# Altium schematic sheet Leaf.SchDoc
size A
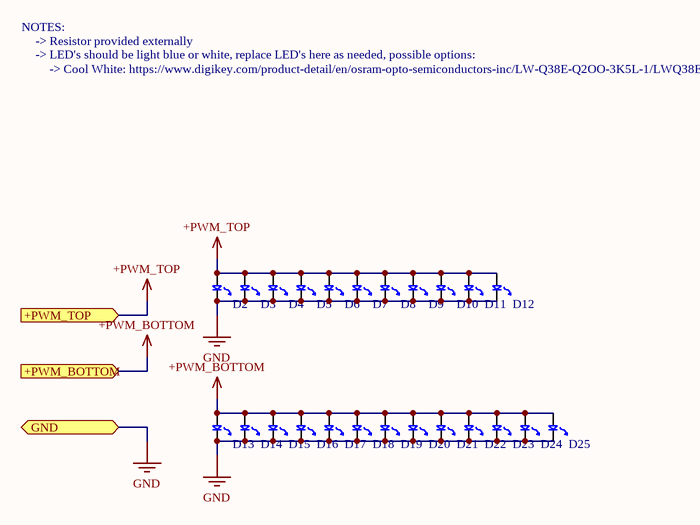
[diagram p0: Leaf.SchDoc]

## Parts
D2  LED_LBQ39G_BLUE  [LED_0603P_BLUE]  (value not drawn)
D3  LED_LBQ39G_BLUE  [LED_0603P_BLUE]  (value not drawn)
D4  LED_LBQ39G_BLUE  [LED_0603P_BLUE]  (value not drawn)
D5  LED_LBQ39G_BLUE  [LED_0603P_BLUE]  (value not drawn)
D6  LED_LBQ39G_BLUE  [LED_0603P_BLUE]  (value not drawn)
D7  LED_LBQ39G_BLUE  [LED_0603P_BLUE]  (value not drawn)
D8  LED_LBQ39G_BLUE  [LED_0603P_BLUE]  (value not drawn)
D9  LED_LBQ39G_BLUE  [LED_0603P_BLUE]  (value not drawn)
D10  LED_LBQ39G_BLUE  [LED_0603P_BLUE]  (value not drawn)
D11  LED_LBQ39G_BLUE  [LED_0603P_BLUE]  (value not drawn)
D12  LED_LBQ39G_BLUE  [LED_0603P_BLUE]  (value not drawn)
D13  LED_LBQ39G_BLUE  [LED_0603P_BLUE]  (value not drawn)
D14  LED_LBQ39G_BLUE  [LED_0603P_BLUE]  (value not drawn)
D15  LED_LBQ39G_BLUE  [LED_0603P_BLUE]  (value not drawn)
D16  LED_LBQ39G_BLUE  [LED_0603P_BLUE]  (value not drawn)
D17  LED_LBQ39G_BLUE  [LED_0603P_BLUE]  (value not drawn)
D18  LED_LBQ39G_BLUE  [LED_0603P_BLUE]  (value not drawn)
D19  LED_LBQ39G_BLUE  [LED_0603P_BLUE]  (value not drawn)
D20  LED_LBQ39G_BLUE  [LED_0603P_BLUE]  (value not drawn)
D21  LED_LBQ39G_BLUE  [LED_0603P_BLUE]  (value not drawn)
D22  LED_LBQ39G_BLUE  [LED_0603P_BLUE]  (value not drawn)
D23  LED_LBQ39G_BLUE  [LED_0603P_BLUE]  (value not drawn)
D24  LED_LBQ39G_BLUE  [LED_0603P_BLUE]  (value not drawn)
D25  LED_LBQ39G_BLUE  [LED_0603P_BLUE]  (value not drawn)

## Ports
+PWM_BOTTOM (in), +PWM_TOP (in), GND (bidir)

## Nets
+PWM_BOTTOM: D13.2 D14.2 D15.2 D16.2 D17.2 D18.2 D19.2 D20.2 D21.2 D22.2 D23.2 D24.2 D25.2 ; port +PWM_BOTTOM
+PWM_TOP: D2.2 D3.2 D4.2 D5.2 D6.2 D7.2 D8.2 D9.2 D10.2 D11.2 D12.2 ; port +PWM_TOP
GND: D2.1 D3.1 D4.1 D5.1 D6.1 D7.1 D8.1 D9.1 D10.1 D11.1 D12.1 D13.1 D14.1 D15.1 D16.1 D17.1 D18.1 D19.1 D20.1 D21.1 D22.1 D23.1 D24.1 D25.1 ; port GND

## Notes on the sheet
- NOTES:
- -> Resistor provided externally
- -> LED's should be light blue or white, replace LED's here as needed, possible options:
- -> Cool White: https://www.digikey.com/product-detail/en/osram-opto-semiconductors-inc/LW-Q38E-Q2OO-3K5L-1/LWQ38E-Q2OO-3K5L-1-ND/2205739

## Library data of the parts
D2-D25 = LED_LBQ39G_BLUE: Blue 470nm LED Indication - Discrete 2.85V 0603 (1608 Metric); Manufacturer: OSRAM Opto Semiconductors Inc.; Manufacturer Part Number: LB Q39G-L2OO-35-1; Lens Color: White; Lens Transparency: Diffused; Millicandela Rating: 29.5mcd; Lens Style/Size: Rectangle with Flat Top, 1.10mm x 0.80mm; Current - Test: 5mA; Viewing Angle: 155°, 135°; Wavelength - Peak: 472nm; Supplier 1: Digi-Key; RoHS: RoHS Compliant; Category: Optoelectronics; Stock 1: 57960; Pricing 1: 1=0.35, 10=0.25, 25=0.2172, 100=0.167, 250=0.13568, 500=0.10018, 1000=0.08349 (USD); Packaging: Cut Tape (CT); Color: Blue; Voltage - Forward (Vf) (Typ): 2.85V; Mounting Type: Surface Mount; Wavelength - Dominant: 470nm; Features: -; Package / Case: 0603 (1608 Metric); Supplier Device Package: *; Size / Dimension: 1.60mm L x 0.80mm W; Height (Max): 0.40mm; ComponentLink1URL: http://media.digikey.com/pdf/Data%20Sheets/Osram%20PDFs/LB_LT%20Q39G.pdf; ComponentLink1Description: http://media.digikey.com/pdf/Data%20Sheets/Osram%20PDFs/LB_LT%20Q39G.pdf; Supplier Part Number 1: 475-2816-1-ND